# EAGLE design touchwheel0 (EAGLE 9.6.2)
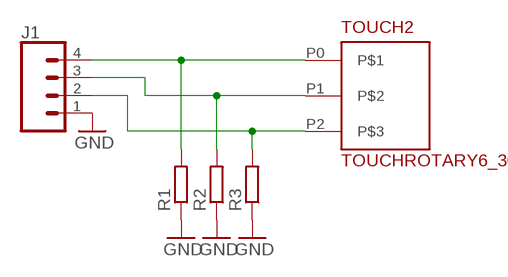
[diagram p0: schematic, sheet 1]

## Parts
J1  CONN_04  [1X04]
R1  R-EU_R0805  [R0805]
R2  R-EU_R0805  [R0805]
R3  R-EU_R0805  [R0805]
TOUCH2  TOUCHROTARY6_30  [TOUCHROTARY1B]

## Nets
GND: J1.1 R1.1 R2.1 R3.1
N$1: J1.4 R1.2 TOUCH2.P0
N$2: J1.3 R2.2 TOUCH2.P1
N$3: J1.2 R3.2 TOUCH2.P2

## Library data of the parts
J1 = SparkFun-Connectors:CONN_04: Multi connection point. Often used as Generic Header-pin footprint for 0.1 inch spaced/style header connections On any of the 0.1 inch spaced packages, you can populate with these: Break Away Headers - Straight <https://www.sparkfun.com/products/116> (PRT-00116) Break Away Male Headers - Right Angle <https://www.sparkfun.com/products/553> (PRT-00553) Female Headers <https://www.sparkfun.com/products/115> (PRT-00115) Break Away Headers - Machine Pin <https://www.sparkfun.com/products/117> (PRT-00117) Break Away Female Headers - Swiss Machine Pin <https://www.sparkfun.com/products/743> (PRT-00743) For SCREWTERMINALS and SPRING TERMINALS visit here: Screw Terimnals on SparkFun.com <https://www.sparkfun.com/search/results?term=Screw+Terminals> (5mm/3.5mm/2.54mm spacing) This device is also useful as a general connection point to wire up your design to another part of your project. Our various solder wires solder well into these plated through hole pads. Hook-Up Wire - Assortment (Stranded, 22 AWG) <https://www.sparkfun.com/products/11375> (PRT-11375) Hook-Up Wire - Assortment (Solid Core, 22 AWG) <https://www.sparkfun.com/products/11367> (PRT-11367) View the entire wire category on our website here <https://www.sparkfun.com/categories/141> Special notes: Molex polarized connector foot print use with SKU : PRT-08231 with associated crimp pins and housings. 1MM SMD Version SKU: PRT-10208; PROD_ID: CONN-09696
R1-R3 = rcl:R-EU_: RESISTOR, European symbol; SPICEPREFIX: R
TOUCH2 = todstuff2023:TOUCHROTARY

## Board
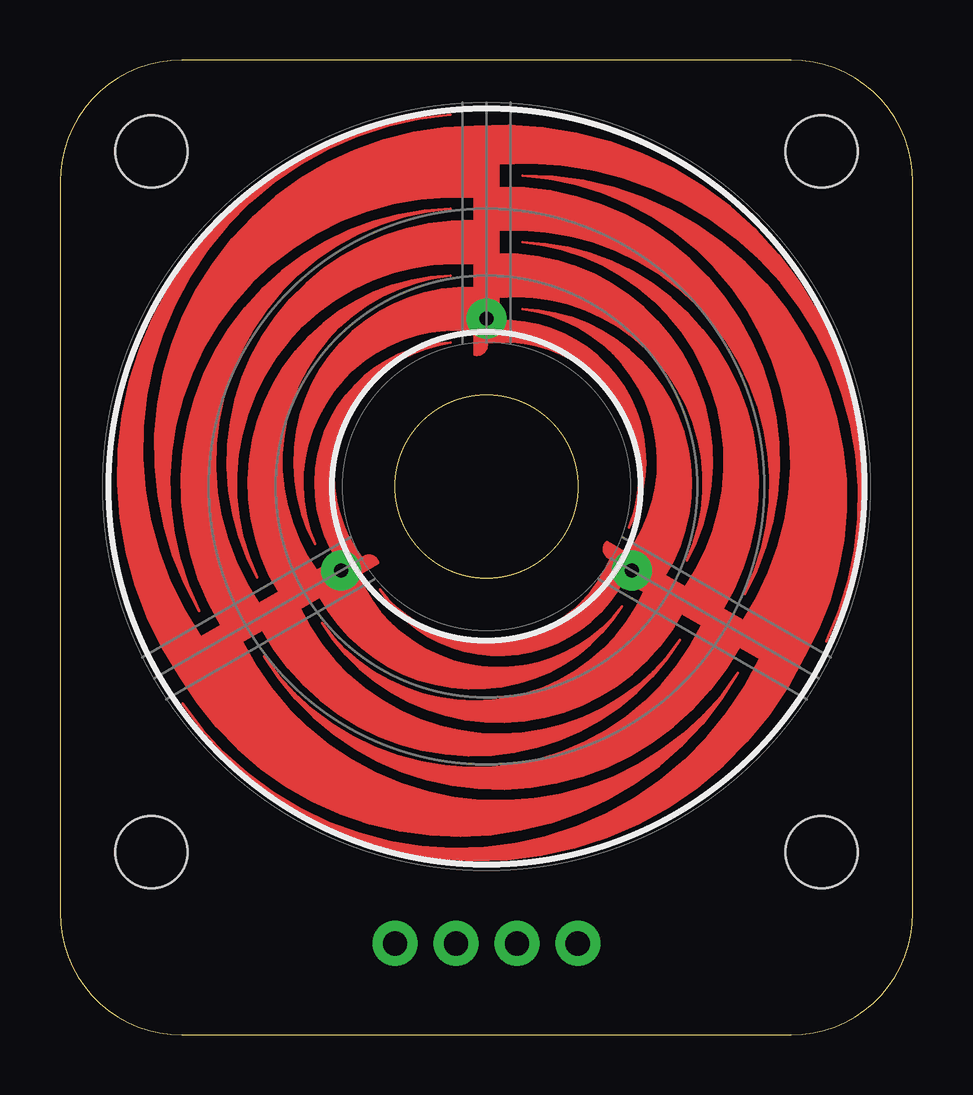
[diagram p1: board, top side]
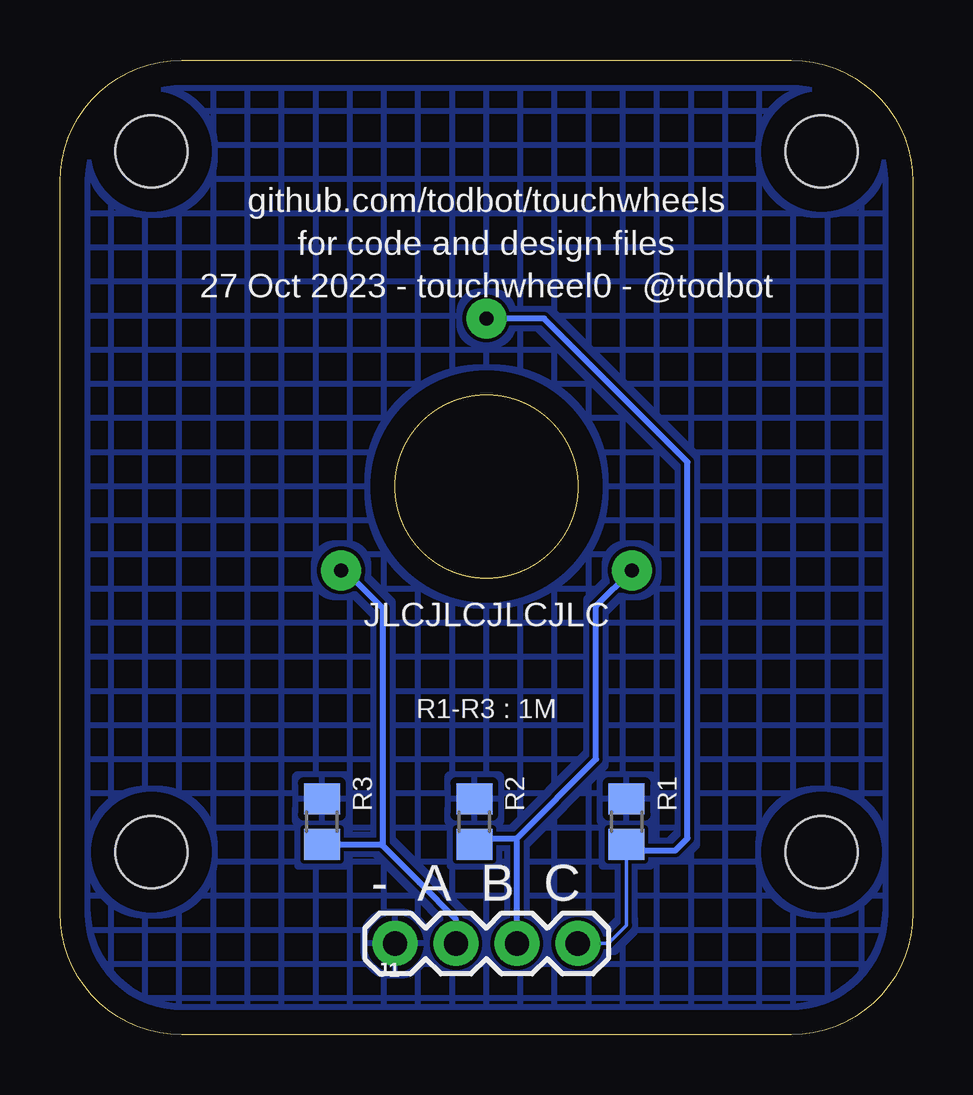
[diagram p2: board, bottom side, seen from below]

Size 35.56 x 40.64 mm. Coordinates in mm from the lower left corner, seen from the top.
Outline: 0,35.56 0,5.08 arc90 5.08,0 30.48,0 arc90 35.56,5.08 35.56,35.56 arc90 30.48,40.64 5.08,40.64 arc90 0,35.56
Outline: circle at 17.78,22.86 radius 3.81
Copper layers (1*16): Top 0.035mm / dielectric 1.5mm / Bottom 0.035mm
Design rules "default": minimum track width 6mil, minimum drill 0.35mm, track to track 6mil, track to pad 6mil, pad to pad 6mil, via to via 6mil, smd to smd 6mil, copper to edge 40mil, drill to drill 6mil, minimum pad ring 10mil, minimum via ring 8mil, stop-mask expansion 4mil, vias tented up to drill 0mil, thermal gap 10mil
Holes 3 mm at 31.75,36.83 3.81,36.83 31.75,7.62 3.81,7.62

### Footprints (pad centres in the part's own frame; a part is rotated, then mirrored left to right if it is on the bottom)
1X04 = drill 1.016 pad 1.88: 1 0,0; 2 2.54,0; 3 5.08,0; 4 7.62,0
R0805 = smd 1.3 x 1.5: 1 -0.95,0; 2 0.95,0
TOUCHROTARY1B = drill 0.6 pad 1.676: P0 7,0; P1 -3.5,6.062; P2 -3.5,-6.062

### Placement (x,y rotation side)
J1  21.59,3.81 0 bottom
R1  11.94,8.89 270 bottom
R2  18.29,8.89 270 bottom
R3  24.64,8.89 270 bottom
TOUCH2  17.78,22.86 90 top

### Tracks (layer width: path | path; a pad name or v marks a point on that pad's centre or on a via)
GND
  pour Bottom (hatched): 36.58,41.15 0,41.15 0,-1.27 36.58,-1.27
N$1
  Bottom 0.152: J1.4 12.7,3.81 11.94,4.57 R1.2
  Bottom 0.254: R1.2 11.68,7.69 9.91,7.69 9.4,8.19 9.4,23.88 15.38,29.86 TOUCH2.P0
N$2
  Bottom 0.254: J1.3 16.51,8.19 | 16.51,8.19 13.21,11.5 13.21,17.87 TOUCH2.P1 | R2.2 18.03,8.19 16.51,8.19
N$3
  Bottom 0.254: TOUCH2.P2 23.68,19.36 22.1,17.78 22.1,8.96 22.1,7.87 | J1.2 19.05,4.83 20.57,6.35 22.1,7.87 | 22.1,7.87 22.16,7.94 R3.2

### Text on the board
bPlace: JLCJLCJLCJLC | R1-R3 : 1M | - A B C
bNames: github.com/todbot/touchwheels / for code and design files / 27 Oct 2023 - touchwheel0 - @todbot